# EAGLE schematic sr_indicator_v0 (EAGLE 6.3)
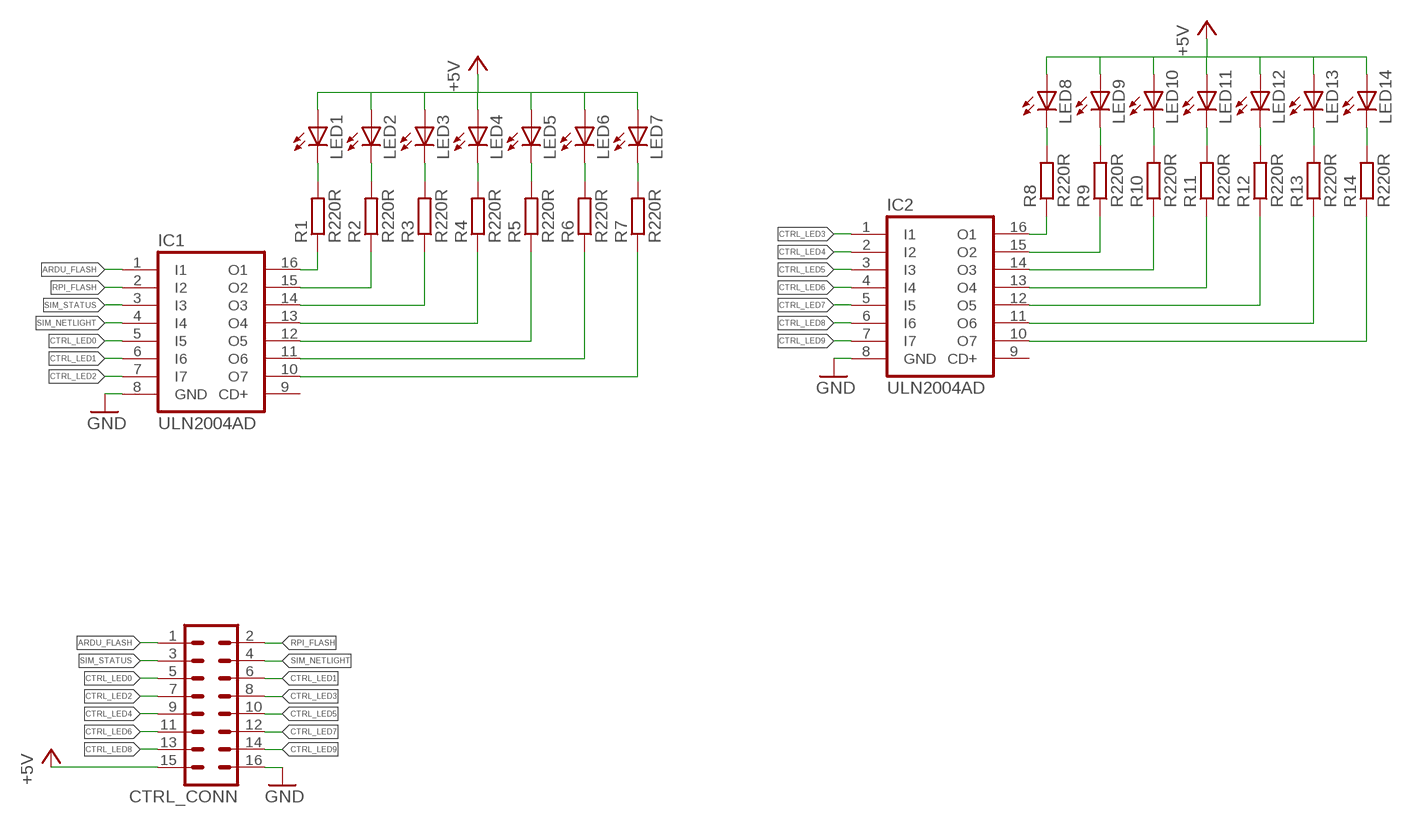
[diagram p0: schematic, sheet 1]

## Parts
CTRL_CONN  MA08-2  [MA08-2]
IC1  ULN2004AD  [SO16]
IC2  ULN2004AD  [SO16]
LED1  LED3MM  [LED3MM]
LED2  LED3MM  [LED3MM]
LED3  LED3MM  [LED3MM]
LED4  LED3MM  [LED3MM]
LED5  LED3MM  [LED3MM]
LED6  LED3MM  [LED3MM]
LED7  LED3MM  [LED3MM]
LED8  LED3MM  [LED3MM]
LED9  LED3MM  [LED3MM]
LED10  LED3MM  [LED3MM]
LED11  LED3MM  [LED3MM]
LED12  LED3MM  [LED3MM]
LED13  LED3MM  [LED3MM]
LED14  LED3MM  [LED3MM]
R1  R220R  R-EU_M0805  [M0805]
R2  R220R  R-EU_M0805  [M0805]
R3  R220R  R-EU_M0805  [M0805]
R4  R220R  R-EU_M0805  [M0805]
R5  R220R  R-EU_M0805  [M0805]
R6  R220R  R-EU_M0805  [M0805]
R7  R220R  R-EU_M0805  [M0805]
R8  R220R  R-EU_M0805  [M0805]
R9  R220R  R-EU_M0805  [M0805]
R10  R220R  R-EU_M0805  [M0805]
R11  R220R  R-EU_M0805  [M0805]
R12  R220R  R-EU_M0805  [M0805]
R13  R220R  R-EU_M0805  [M0805]
R14  R220R  R-EU_M0805  [M0805]

## Nets
+5V: CTRL_CONN.15 LED1.A LED2.A LED3.A LED4.A LED5.A LED6.A LED7.A LED8.A LED9.A LED10.A LED11.A LED12.A LED13.A LED14.A
ARDU_FLASH: CTRL_CONN.1 IC1.1(I1)
CTRL_LED0: CTRL_CONN.5 IC1.5(I5)
CTRL_LED1: CTRL_CONN.6 IC1.6(I6)
CTRL_LED2: CTRL_CONN.7 IC1.7(I7)
CTRL_LED3: CTRL_CONN.8 IC2.1(I1)
CTRL_LED4: CTRL_CONN.9 IC2.2(I2)
CTRL_LED5: CTRL_CONN.10 IC2.3(I3)
CTRL_LED6: CTRL_CONN.11 IC2.4(I4)
CTRL_LED7: CTRL_CONN.12 IC2.5(I5)
CTRL_LED8: CTRL_CONN.13 IC2.6(I6)
CTRL_LED9: CTRL_CONN.14 IC2.7(I7)
GND: CTRL_CONN.16 IC1.8(GND) IC2.8(GND)
N$1: IC1.16(O1) R1.1
N$2: IC1.15(O2) R2.1
N$3: IC1.14(O3) R3.1
N$4: IC1.13(O4) R4.1
N$5: IC1.12(O5) R5.1
N$6: IC1.11(O6) R6.1
N$7: IC1.10(O7) R7.1
N$8: LED1.K(C) R1.2
N$9: LED2.K(C) R2.2
N$10: LED3.K(C) R3.2
N$11: LED4.K(C) R4.2
N$12: LED5.K(C) R5.2
N$13: LED6.K(C) R6.2
N$14: LED7.K(C) R7.2
N$15: IC2.16(O1) R8.1
N$16: IC2.15(O2) R9.1
N$17: IC2.14(O3) R10.1
N$18: IC2.13(O4) R11.1
N$19: IC2.12(O5) R12.1
N$20: IC2.11(O6) R13.1
N$21: IC2.10(O7) R14.1
N$22: LED8.K(C) R8.2
N$23: LED9.K(C) R9.2
N$24: LED10.K(C) R10.2
N$25: LED11.K(C) R11.2
N$26: LED12.K(C) R12.2
N$27: LED13.K(C) R13.2
N$28: LED14.K(C) R14.2
RPI_FLASH: CTRL_CONN.2 IC1.2(I2)
SIM_NETLIGHT: CTRL_CONN.4 IC1.4(I4)
SIM_STATUS: CTRL_CONN.3 IC1.3(I3)
Unconnected: IC1.9(CD+) IC2.9(CD+)

## Library data of the parts
CTRL_CONN = con-lstb:MA08-2: PIN HEADER; OC_FARNELL: unknown; OC_NEWARK: unknown
IC1 IC2 = uln-udn:ULN2004A: DRIVER ARRAY
LED1-LED14 = adafruit:LED: LED OSRAM: - CHIPLED LG R971, LG N971, LY N971, LG Q971, LY Q971, LO R971, LY R971 LH N974, LH R974 LS Q976, LO Q976, LY Q976 LO Q996 - Hyper CHIPLED LW Q18S LB Q993, LB Q99A, LB R99A - SideLED LS A670, LO A670, LY A670, LG A670, LP A670 LB A673, LV A673, LT A673, LW A673 LH A674 LY A675 LS A676, LA A676, LO A676, LY A676, LW A676 LS A679, LY A679, LG A679 - Hyper Micro SIDELED® LS Y876, LA Y876, LO Y876, LY Y876 LT Y87S - SmartLED LW L88C, LW L88S LB L89C, LB L89S, LG L890 LS L89K, LO L89K, LY L89K LS L896, LA L896, LO L896, LY L896 - TOPLED LS T670, LO T670, LY T670, LG T670, LP T670 LSG T670, LSP T670, LSY T670, LOP T670, LYG T670 LG T671, LOG T671, LSG T671 LB T673, LV T673, LT T673, LW T673 LH T674 LS T676, LA T676, LO T676, LY T676, LB T676, LH T676, LSB T676, LW T676 LB T67C, LV T67C, LT T67C, LS T67K, LO T67K, LY T67K, LW E67C LS E67B, LA E67B, LO E67B, LY E67B, LB E67C, LV E67C, LT E67C LW T67C LS T679, LY T679, LG T679 LS T770, LO T770, LY T770, LG T770, LP T770 LB T773, LV T773, LT T773, LW T773 LH T774 LS E675, LA E675, LY E675, LS T675 LS T776, LA T776, LO T776, LY T776, LB T776 LHGB T686 LT T68C, LB T68C - Hyper Mini TOPLED® LB M676 - Mini TOPLED Santana® LG M470 LS M47K, LO M47K, LY M47K Source: http://www.osram.convergy.de/
R1-R14 = resistor:R-EU_: RESISTOR, European symbol